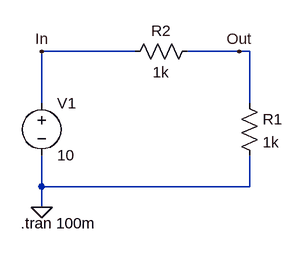
[diagram p0: schematic Resistive_Voltage_Divider_1.2.asc]
Resistive_Voltage_Divider_1.2.asc, the LTspice schematic file:
Version 4.1
SHEET 1 880 680
WIRE 176 64 32 64
WIRE 336 64 256 64
WIRE 352 64 336 64
WIRE 32 144 32 64
WIRE 352 144 352 64
WIRE 32 272 32 224
WIRE 352 272 352 224
WIRE 352 272 32 272
WIRE 32 304 32 272
FLAG 32 304 0
FLAG 32 64 In
FLAG 336 64 Out
SYMBOL voltage 32 128 R0
SYMATTR InstName V1
SYMATTR Value 10
SYMBOL res 336 128 R0
SYMATTR InstName R1
SYMATTR Value 1k
SYMBOL res 272 48 R90
WINDOW 0 0 56 VBottom 2
WINDOW 3 32 56 VTop 2
SYMATTR InstName R2
SYMATTR Value 1k
TEXT 0 328 Left 2 !.tran 100m

The netlist it stands for:
* Resistive_Voltage_Divider_1.2.asc
V1 In 0 10
R1 Out 0 1k
R2 Out In 1k
.tran 100m
.backanno
.end